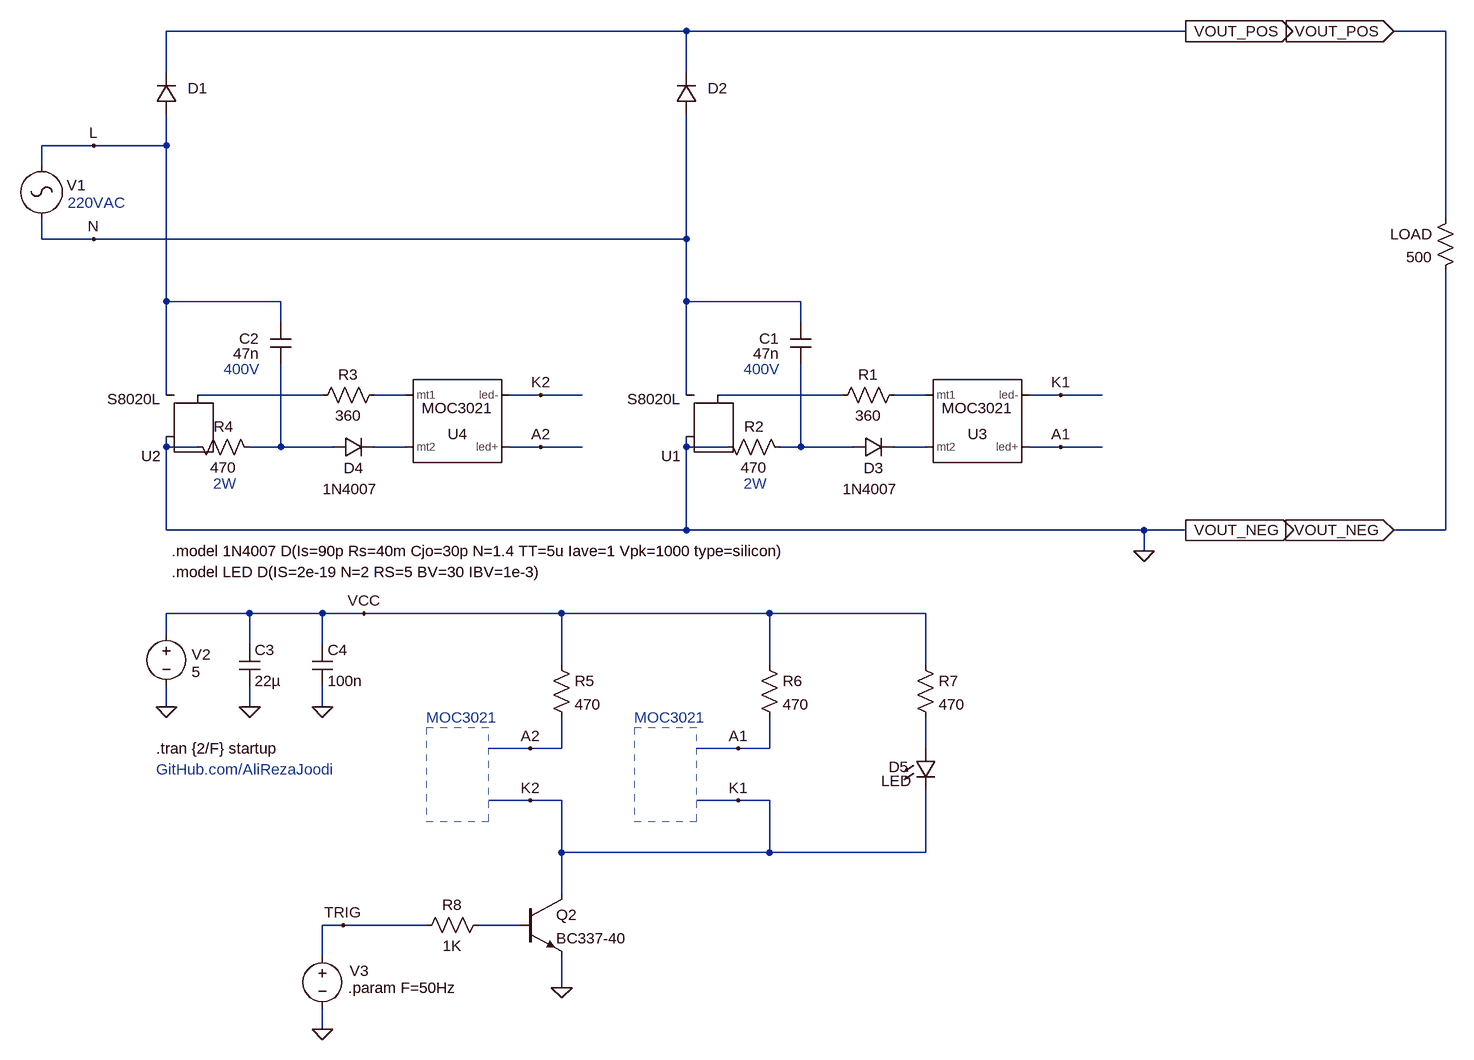
[diagram p0: schematic v1.0.asc]
v1.0.asc, the LTspice schematic file:
Version 4.1
SHEET 1 2356 1584
WIRE 1008 -208 208 -208
WIRE 1776 -208 1008 -208
WIRE 2176 -208 2096 -208
WIRE 208 -144 208 -208
WIRE 1008 -144 1008 -208
WIRE 96 -32 16 -32
WIRE 208 -32 208 -80
WIRE 208 -32 96 -32
WIRE 16 0 16 -32
WIRE 2176 80 2176 -208
WIRE 16 112 16 80
WIRE 96 112 16 112
WIRE 1008 112 1008 -80
WIRE 1008 112 96 112
WIRE 208 208 208 -32
WIRE 384 208 208 208
WIRE 1008 208 1008 112
WIRE 1184 208 1008 208
WIRE 384 240 384 208
WIRE 1184 240 1184 208
WIRE 208 352 208 208
WIRE 448 352 256 352
WIRE 576 352 528 352
WIRE 784 352 736 352
WIRE 848 352 784 352
WIRE 1008 352 1008 208
WIRE 1248 352 1056 352
WIRE 1376 352 1328 352
WIRE 1584 352 1536 352
WIRE 1648 352 1584 352
WIRE 208 432 208 416
WIRE 256 432 208 432
WIRE 384 432 384 304
WIRE 384 432 336 432
WIRE 464 432 384 432
WIRE 576 432 528 432
WIRE 784 432 736 432
WIRE 848 432 784 432
WIRE 1008 432 1008 416
WIRE 1072 432 1008 432
WIRE 1184 432 1184 304
WIRE 1184 432 1152 432
WIRE 1264 432 1184 432
WIRE 1376 432 1328 432
WIRE 1584 432 1536 432
WIRE 1648 432 1584 432
WIRE 208 560 208 432
WIRE 1008 560 1008 432
WIRE 1008 560 208 560
WIRE 1712 560 1008 560
WIRE 1776 560 1712 560
WIRE 2176 560 2176 160
WIRE 2176 560 2096 560
WIRE 1712 592 1712 560
WIRE 336 688 208 688
WIRE 448 688 336 688
WIRE 512 688 448 688
WIRE 816 688 512 688
WIRE 1136 688 816 688
WIRE 1376 688 1136 688
WIRE 208 720 208 688
WIRE 336 736 336 688
WIRE 448 736 448 688
WIRE 816 768 816 688
WIRE 1136 768 1136 688
WIRE 1376 768 1376 688
WIRE 208 832 208 800
WIRE 336 832 336 800
WIRE 448 832 448 800
WIRE 768 896 704 896
WIRE 816 896 816 848
WIRE 816 896 768 896
WIRE 1088 896 1024 896
WIRE 1136 896 1136 848
WIRE 1136 896 1088 896
WIRE 1376 896 1376 848
WIRE 768 976 704 976
WIRE 816 976 768 976
WIRE 1088 976 1024 976
WIRE 1136 976 1088 976
WIRE 816 1056 816 976
WIRE 1136 1056 1136 976
WIRE 1136 1056 816 1056
WIRE 1376 1056 1376 960
WIRE 1376 1056 1136 1056
WIRE 816 1120 816 1056
WIRE 480 1168 448 1168
WIRE 608 1168 480 1168
WIRE 752 1168 688 1168
WIRE 448 1216 448 1168
WIRE 816 1264 816 1216
WIRE 448 1328 448 1296
FLAG 448 1328 0
FLAG 96 -32 L
FLAG 208 832 0
FLAG 512 688 VCC
FLAG 448 832 0
FLAG 336 832 0
FLAG 1712 592 0
FLAG 2096 -208 VOUT_POS
IOPIN 2096 -208 In
FLAG 2096 560 VOUT_NEG
IOPIN 2096 560 In
FLAG 816 1264 0
FLAG 480 1168 TRIG
FLAG 1776 -208 VOUT_POS
IOPIN 1776 -208 Out
FLAG 1776 560 VOUT_NEG
IOPIN 1776 560 Out
FLAG 96 112 N
FLAG 1584 432 A1
FLAG 1584 352 K1
FLAG 784 432 A2
FLAG 784 352 K2
FLAG 768 896 A2
FLAG 768 976 K2
FLAG 1088 896 A1
FLAG 1088 976 K1
SYMBOL res 2192 64 M0
SYMATTR InstName LOAD
SYMATTR Value 500
SYMBOL res 800 752 R0
SYMATTR InstName R5
SYMATTR Value 470
SYMBOL voltage 448 1200 R0
WINDOW 3 -49 -29 Invisible 2
WINDOW 123 0 0 Left 0
WINDOW 39 0 0 Left 0
WINDOW 0 42 38 Left 2
SYMATTR Value PULSE(0 3.3 4m 1n 1n 200u {1/(2*F)})
SYMATTR InstName V3
SYMBOL voltage 208 704 R0
WINDOW 0 39 47 Left 2
WINDOW 3 39 74 Left 2
WINDOW 123 0 0 Left 0
WINDOW 39 0 0 Left 0
SYMATTR InstName V2
SYMATTR Value 5
SYMBOL LED 1360 896 R0
WINDOW 0 -41 28 Left 2
WINDOW 3 -52 50 Left 2
SYMATTR InstName D5
SYMATTR Value LED
SYMBOL res 1360 752 R0
SYMATTR InstName R7
SYMATTR Value 470
SYMBOL cap 320 736 R0
SYMATTR InstName C3
SYMATTR Value 22µ
SYMBOL cap 432 736 R0
SYMATTR InstName C4
SYMATTR Value 100n
SYMBOL MyLib\\Voltage_AC 16 -16 M0
WINDOW 123 0 0 Left 0
WINDOW 39 0 0 Left 0
WINDOW 3 41 64 Invisible 2
WINDOW 0 -68 45 Left 2
SYMATTR Value SINE(0 325 {F})
SYMATTR InstName V1
SYMBOL npn 752 1120 R0
SYMATTR InstName Q2
SYMATTR Value BC337-40
SYMBOL res 592 1184 R270
WINDOW 0 32 56 VTop 2
WINDOW 3 0 56 VBottom 2
SYMATTR InstName R8
SYMATTR Value 1K
SYMBOL res 1344 336 R90
WINDOW 0 0 56 VBottom 2
WINDOW 3 32 56 VTop 2
SYMATTR InstName R1
SYMATTR Value 360
SYMBOL res 1056 416 M90
WINDOW 0 0 56 VBottom 2
WINDOW 3 32 56 VTop 2
SYMATTR InstName R2
SYMATTR Value 470
SYMATTR SpiceLine pwr=2
SYMBOL cap 1200 304 R180
WINDOW 0 49 39 Left 2
WINDOW 3 49 16 Left 2
SYMATTR InstName C1
SYMATTR Value 47n
SYMATTR SpiceLine V=400
SYMBOL MyLib\\Opto\\MOC3021 1488 416 R180
SYMATTR InstName U3
SYMBOL diode 1264 448 R270
WINDOW 0 -32 32 VTop 2
WINDOW 3 -33 27 VBottom 2
SYMATTR InstName D3
SYMATTR Value 1N4007
SYMBOL res 544 336 R90
WINDOW 0 0 56 VBottom 2
WINDOW 3 32 56 VTop 2
SYMATTR InstName R3
SYMATTR Value 360
SYMBOL res 240 416 M90
WINDOW 0 0 56 VBottom 2
WINDOW 3 32 56 VTop 2
SYMATTR InstName R4
SYMATTR Value 470
SYMATTR SpiceLine pwr=2
SYMBOL cap 400 304 R180
WINDOW 0 49 39 Left 2
WINDOW 3 49 16 Left 2
SYMATTR InstName C2
SYMATTR Value 47n
SYMATTR SpiceLine V=400
SYMBOL MyLib\\Opto\\MOC3021 688 416 R180
SYMATTR InstName U4
SYMBOL diode 464 448 R270
WINDOW 0 -32 32 VTop 2
WINDOW 3 -33 27 VBottom 2
SYMATTR InstName D4
SYMATTR Value 1N4007
SYMBOL res 1120 752 R0
SYMATTR InstName R6
SYMATTR Value 470
SYMBOL diode 192 -80 M180
WINDOW 0 49 40 Left 2
WINDOW 3 48 16 Invisible 2
SYMATTR InstName D1
SYMBOL diode 992 -80 M180
WINDOW 0 49 40 Left 2
WINDOW 3 48 16 Invisible 2
SYMATTR InstName D2
SYMBOL MyLib\\Thyristor_SCR\\S8020L 224 416 R180
WINDOW 38 48 39 Invisible 2
SYMATTR InstName U2
SYMBOL MyLib\\Thyristor_SCR\\S8020L 1024 416 R180
WINDOW 38 48 39 Invisible 2
SYMATTR InstName U1
TEXT 192 896 Left 2 !.tran {2/F} startup
TEXT 216 624 Left 2 !.model LED D(IS=2e-19 N=2 RS=5 BV=30 IBV=1e-3)
TEXT 488 1264 Left 2 !.param F=50Hz
TEXT 608 848 Left 2 ;MOC3021
TEXT 928 848 Left 2 ;MOC3021
TEXT 296 312 Left 2 ;400V
TEXT 1096 312 Left 2 ;400V
TEXT 56 56 Left 2 ;220VAC
TEXT 192 928 Left 2 ;GitHub.com/AliRezaJoodi
TEXT 216 592 Left 2 !.model 1N4007 D(Is=90p Rs=40m Cjo=30p N=1.4 TT=5u Iave=1 Vpk=1000 type=silicon)
TEXT 1096 488 Left 2 ;2W
TEXT 280 488 Left 2 ;2W
RECTANGLE Normal 608 1008 704 864 2
RECTANGLE Normal 928 1008 1024 864 2

The netlist it stands for:
* v1.0.asc
R§LOAD VOUT_POS 0 500
R5 VCC A2 470
V3 TRIG 0 PULSE(0 3.3 4m 1n 1n 200u {1/(2*F)})
V2 VCC 0 5
D5 N009 K2 LED
R7 VCC N009 470
C3 VCC 0 22µ
C4 VCC 0 100n
V1 L N SINE(0 325 {F})
Q2 K2 N010 0 0 BC337-40
R8 TRIG N010 1K
R1 N004 N003 360
R2 0 N007 470 pwr=2
C1 N007 N 47n V=400
X§U3 A1 K2 N008 N004 MOC3021  ; pins led+ led- mt2 mt1
D3 N007 N008 1N4007
R3 N002 N001 360
R4 0 N005 470 pwr=2
C2 N005 L 47n V=400
X§U4 A2 K2 N006 N002 MOC3021  ; pins led+ led- mt2 mt1
D4 N005 N006 1N4007
R6 VCC A1 470
D1 L VOUT_POS D
D2 N VOUT_POS D
X§U2 0 N001 L S8020L  ; pins A G K
X§U1 0 N003 N S8020L  ; pins A G K
.model D D
.lib standard.dio
.model NPN NPN
.model PNP PNP
.lib standard.bjt
.tran {2/F} startup
.model LED D(IS=2e-19 N=2 RS=5 BV=30 IBV=1e-3)
.param F=50Hz
* MOC3021
* MOC3021
* 400V
* 400V
* 220VAC
* GitHub.com/AliRezaJoodi
.model 1N4007 D(Is=90p Rs=40m Cjo=30p N=1.4 TT=5u Iave=1 Vpk=1000 type=silicon)
* 2W
* 2W
.lib MOC3021.lib
.backanno
.end